# Altium schematic sheet Main.SchDoc
size A4
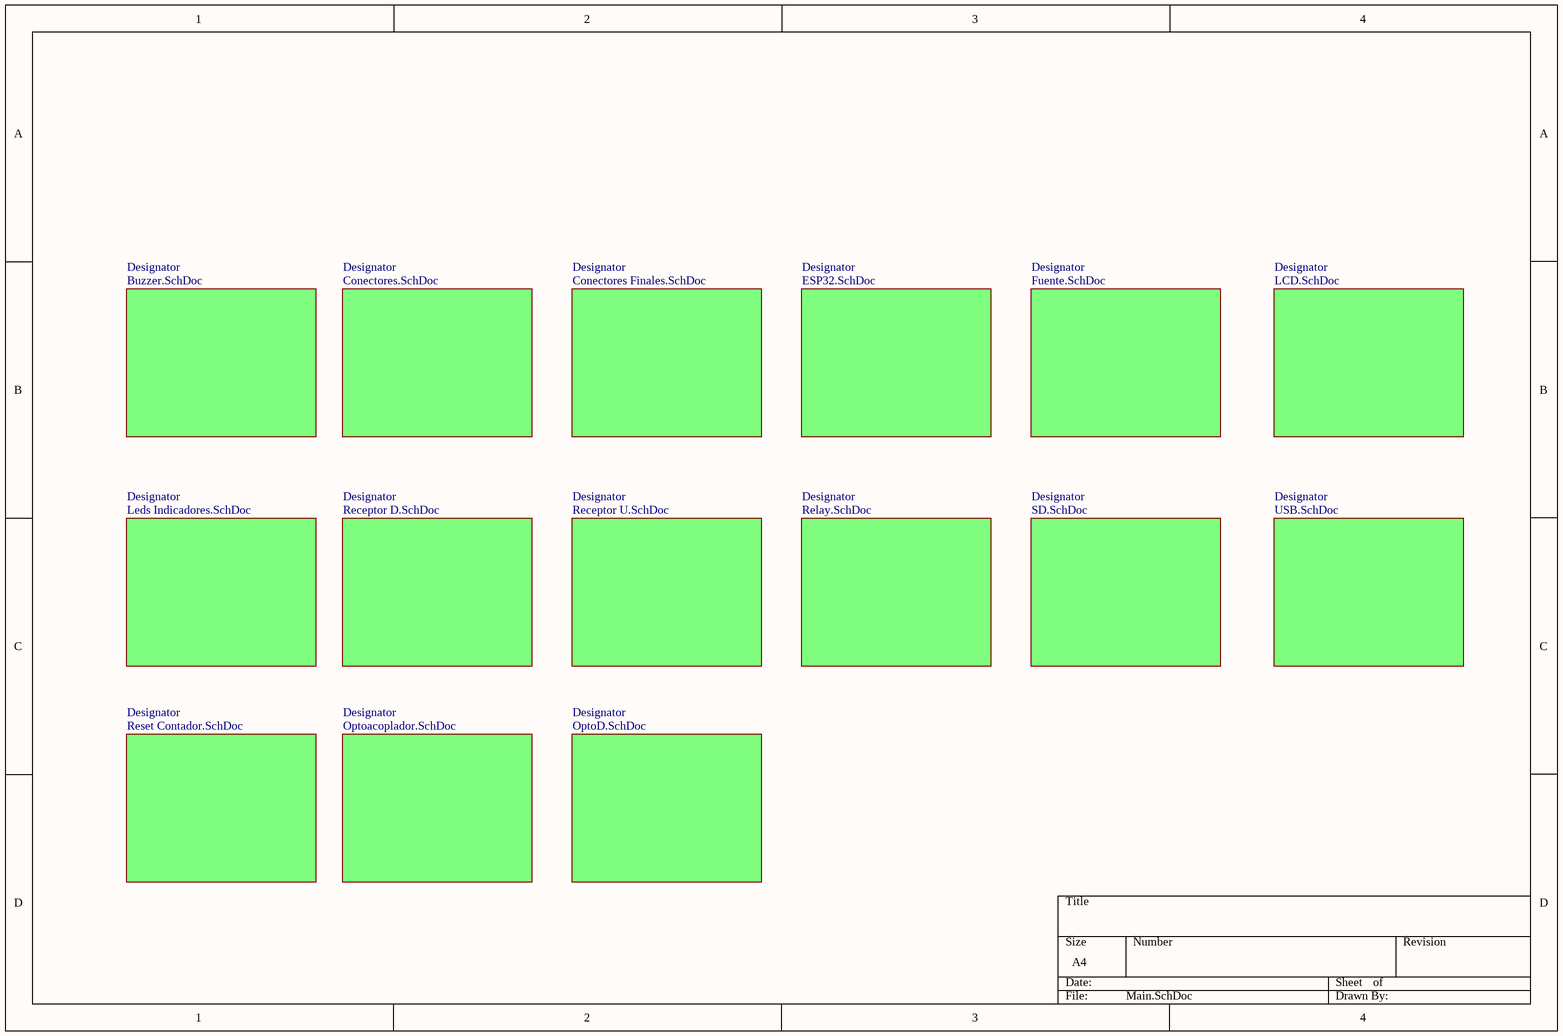
[diagram p0: Main.SchDoc]

## Sub-sheets
Designator = Buzzer.SchDoc: no entries
Designator = Conectores.SchDoc: no entries
Designator = Conectores Finales.SchDoc: no entries
Designator = ESP32.SchDoc: no entries
Designator = Fuente.SchDoc: no entries
Designator = LCD.SchDoc: no entries
Designator = Leds Indicadores.SchDoc: no entries
Designator = Receptor D.SchDoc: no entries
Designator = Receptor U.SchDoc: no entries
Designator = Relay.SchDoc: no entries
Designator = SD.SchDoc: no entries
Designator = USB.SchDoc: no entries
Designator = Reset Contador.SchDoc: no entries
Designator = Optoacoplador.SchDoc: no entries
Designator = OptoD.SchDoc: no entries